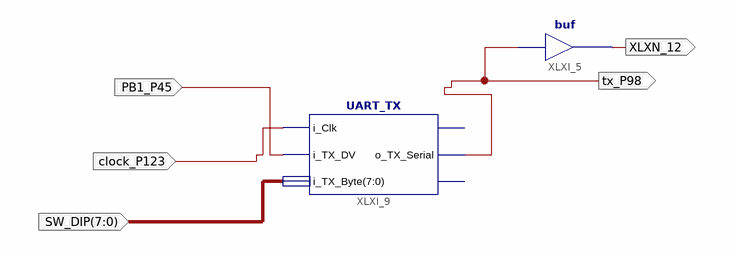
[diagram p0: schematic sheet 1]
// Xilinx ISE schematic main.sch (spartan6) as structural Verilog: 2 symbols, 5 ports
module main (
  input  PB1_P45,
  input  clock_P123,
  input  [7:0] SW_DIP,
  output tx_P98,
  output XLXN_12
);

  buf XLXI_5 (XLXN_12, tx_P98);
  UART_TX XLXI_9 (
    .i_Clk(clock_P123), .i_TX_DV(PB1_P45), .i_TX_Byte(SW_DIP), .o_TX_Serial(tx_P98));  // open: o_TX_Active, o_TX_Done
endmodule
